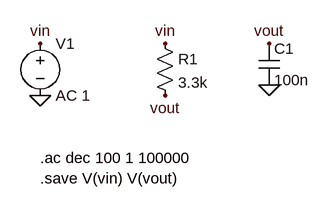
[diagram p0: schematic filtro_rc.asc]
filtro_rc.asc, the LTspice schematic file:
Version 4
SHEET 1 880 680
SYMBOL voltage 48 80 R0
SYMATTR InstName V1
SYMATTR Value AC 1
SYMBOL res 224 80 R0
SYMATTR InstName R1
SYMATTR Value 3.3k
SYMBOL cap 384 96 R0
SYMATTR InstName C1
SYMATTR Value 100n
FLAG 48 96 vin
FLAG 48 176 0
FLAG 240 96 vin
FLAG 240 176 vout
FLAG 400 96 vout
FLAG 400 160 0
TEXT 48 272 Left 2 !.ac dec 100 1 100000
TEXT 48 304 Left 2 !.save V(vin) V(vout)

The netlist it stands for:
* filtro_rc.asc
V1 vin 0 AC 1
R1 vin vout 3.3k
C1 vout 0 100n
.ac dec 100 1 100000
.save V(vin) V(vout)
.backanno
.end